# Altium schematic sheet FPGA power v3.SchDoc
size A; DocumentNumber: 2; SheetNumber: 2; SheetTotal: 6
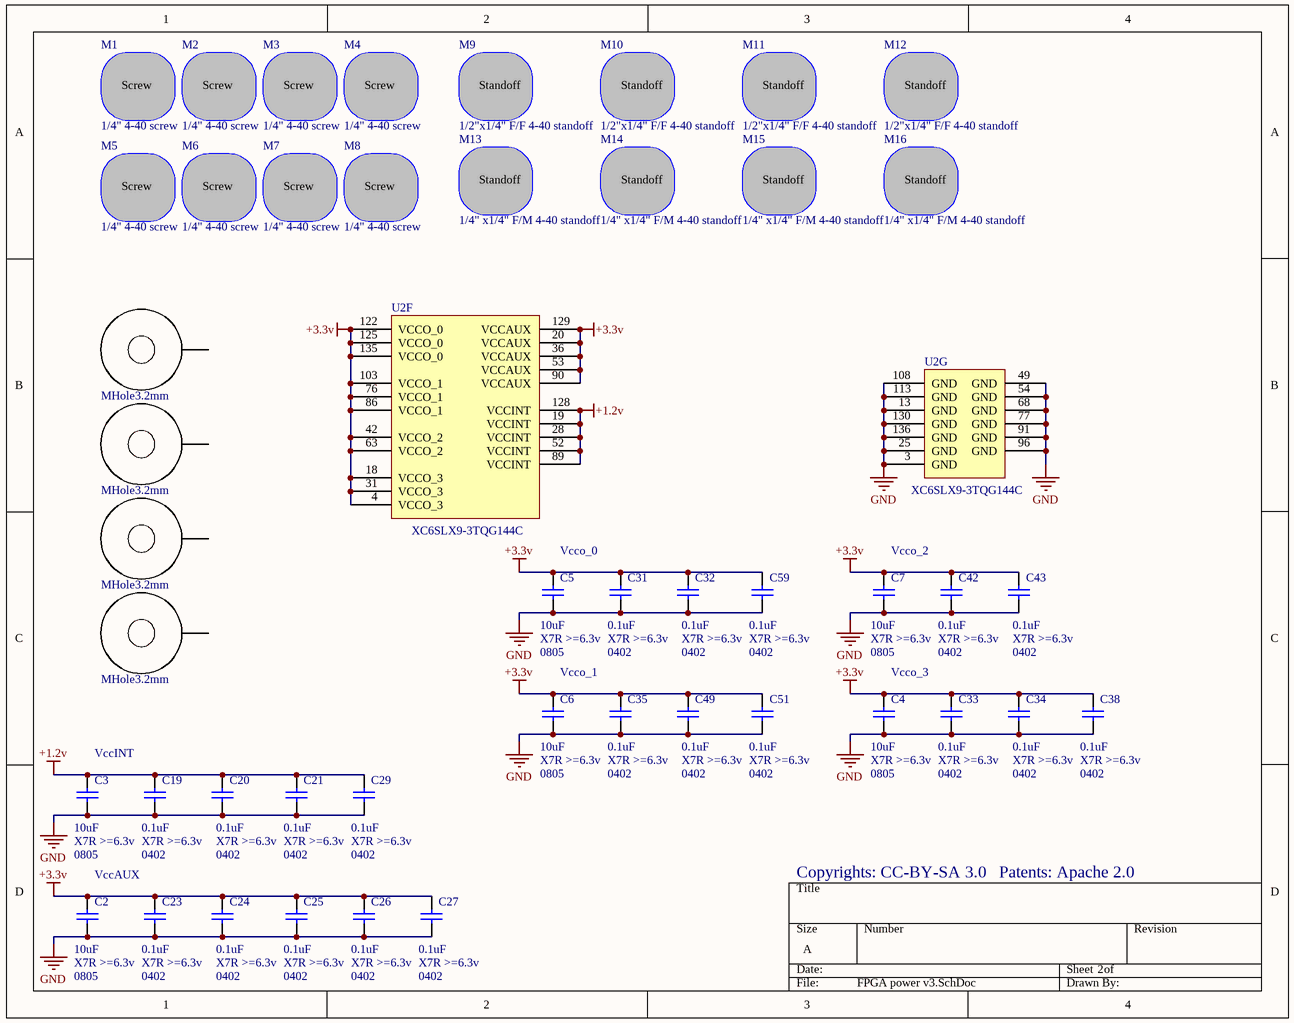
[diagram p0: FPGA power v3.SchDoc]

## Parts
C2  value 10uF  PackageReference: 0805  Rating: X7R >=6.3v  [CAPC2012N]  (hidden comment: Cap Semi)
C3  value 10uF  PackageReference: 0805  Rating: X7R >=6.3v  [CAPC2012N]  (hidden comment: Cap Semi)
C4  value 10uF  PackageReference: 0805  Rating: X7R >=6.3v  [CAPC2012N]  (hidden comment: Cap Semi)
C5  value 10uF  PackageReference: 0805  Rating: X7R >=6.3v  [CAPC2012N]  (hidden comment: Cap Semi)
C6  value 10uF  PackageReference: 0805  Rating: X7R >=6.3v  [CAPC2012N]  (hidden comment: Cap Semi)
C7  value 10uF  PackageReference: 0805  Rating: X7R >=6.3v  [CAPC2012N]  (hidden comment: Cap Semi)
C19  value 0.1uF  PackageReference: 0402  Rating: X7R >=6.3v  [CAPC1005N]  (hidden comment: Cap Semi)
C20  value 0.1uF  PackageReference: 0402  Rating: X7R >=6.3v  [CAPC1005N]  (hidden comment: Cap Semi)
C21  value 0.1uF  PackageReference: 0402  Rating: X7R >=6.3v  [CAPC1005N]  (hidden comment: Cap Semi)
C23  value 0.1uF  PackageReference: 0402  Rating: X7R >=6.3v  [CAPC1005N]  (hidden comment: Cap Semi)
C24  value 0.1uF  PackageReference: 0402  Rating: X7R >=6.3v  [CAPC1005N]  (hidden comment: Cap Semi)
C25  value 0.1uF  PackageReference: 0402  Rating: X7R >=6.3v  [CAPC1005N]  (hidden comment: Cap Semi)
C26  value 0.1uF  PackageReference: 0402  Rating: X7R >=6.3v  [CAPC1005N]  (hidden comment: Cap Semi)
C27  value 0.1uF  PackageReference: 0402  Rating: X7R >=6.3v  [CAPC1005N]  (hidden comment: Cap Semi)
C29  value 0.1uF  PackageReference: 0402  Rating: X7R >=6.3v  [CAPC1005N]  (hidden comment: Cap Semi)
C31  value 0.1uF  PackageReference: 0402  Rating: X7R >=6.3v  [CAPC1005N]  (hidden comment: Cap Semi)
C32  value 0.1uF  PackageReference: 0402  Rating: X7R >=6.3v  [CAPC1005N]  (hidden comment: Cap Semi)
C33  value 0.1uF  PackageReference: 0402  Rating: X7R >=6.3v  [CAPC1005N]  (hidden comment: Cap Semi)
C34  value 0.1uF  PackageReference: 0402  Rating: X7R >=6.3v  [CAPC1005N]  (hidden comment: Cap Semi)
C35  value 0.1uF  PackageReference: 0402  Rating: X7R >=6.3v  [CAPC1005N]  (hidden comment: Cap Semi)
C38  value 0.1uF  PackageReference: 0402  Rating: X7R >=6.3v  [CAPC1005N]  (hidden comment: Cap Semi)
C42  value 0.1uF  PackageReference: 0402  Rating: X7R >=6.3v  [CAPC1005N]  (hidden comment: Cap Semi)
C43  value 0.1uF  PackageReference: 0402  Rating: X7R >=6.3v  [CAPC1005N]  (hidden comment: Cap Semi)
C49  value 0.1uF  PackageReference: 0402  Rating: X7R >=6.3v  [CAPC1005N]  (hidden comment: Cap Semi)
C51  value 0.1uF  PackageReference: 0402  Rating: X7R >=6.3v  [CAPC1005N]  (hidden comment: Cap Semi)
C59  value 0.1uF  PackageReference: 0402  Rating: X7R >=6.3v  [CAPC1005N]  (hidden comment: Cap Semi)
H1  MHole3.2mm  [mounting hole]  (no BOM)
H2  MHole3.2mm  [mounting hole]  (no BOM)
H3  MHole3.2mm  [mounting hole]  (no BOM)
H4  MHole3.2mm  [mounting hole]  (no BOM)
M1  1/4" 4-40 screw  [fiducial]  (mechanical)
M2  1/4" 4-40 screw  [fiducial]  (mechanical)
M3  1/4" 4-40 screw  [fiducial]  (mechanical)
M4  1/4" 4-40 screw  [fiducial]  (mechanical)
M5  1/4" 4-40 screw  [fiducial]  (mechanical)
M6  1/4" 4-40 screw  [fiducial]  (mechanical)
M7  1/4" 4-40 screw  [fiducial]  (mechanical)
M8  1/4" 4-40 screw  [fiducial]  (mechanical)
M9  1/2"x1/4" F/F 4-40 standoff  [fiducial]  (mechanical)
M10  1/2"x1/4" F/F 4-40 standoff  [fiducial]  (mechanical)
M11  1/2"x1/4" F/F 4-40 standoff  [fiducial]  (mechanical)
M12  1/2"x1/4" F/F 4-40 standoff  [fiducial]  (mechanical)
M13  1/4" x1/4" F/M 4-40 standoff  [fiducial]  (mechanical)
M14  1/4" x1/4" F/M 4-40 standoff  [fiducial]  (mechanical)
M15  1/4" x1/4" F/M 4-40 standoff  [fiducial]  (mechanical)
M16  1/4" x1/4" F/M 4-40 standoff  [fiducial]  (mechanical)
U2  XC6SLX9-3TQG144C  [TQG144_N]  (parts F,G of 7)

## Nets
+1.2v: C3.2 C19.2 C20.2 C21.2 C29.2 U2.19(VCCINT) U2.28(VCCINT) U2.52(VCCINT) U2.89(VCCINT) U2.128(VCCINT)
+3.3v: C2.2 C4.2 C5.2 C6.2 C7.2 C23.2 C24.2 C25.2 C26.2 C27.2 C31.2 C32.2 C33.2 C34.2 C35.2 C38.2 C42.2 C43.2 C49.2 C51.2 C59.2 U2.4(VCCO_3) U2.18(VCCO_3) U2.20(VCCAUX) U2.31(VCCO_3) U2.36(VCCAUX) U2.42(VCCO_2) U2.53(VCCAUX) U2.63(VCCO_2) U2.76(VCCO_1) U2.86(VCCO_1) U2.90(VCCAUX) U2.103(VCCO_1) U2.122(VCCO_0) U2.125(VCCO_0) U2.129(VCCAUX) U2.135(VCCO_0)
GND: C2.1 C3.1 C4.1 C5.1 C6.1 C7.1 C19.1 C20.1 C21.1 C23.1 C24.1 C25.1 C26.1 C27.1 C29.1 C31.1 C32.1 C33.1 C34.1 C35.1 C38.1 C42.1 C43.1 C49.1 C51.1 C59.1 U2.3(GND) U2.13(GND) U2.25(GND) U2.49(GND) U2.54(GND) U2.68(GND) U2.77(GND) U2.91(GND) U2.96(GND) U2.108(GND) U2.113(GND) U2.130(GND) U2.136(GND)

Not connected (* = marked no-connect by the designer): H1 1; H2 1; H3 1; H4 1

## Notes on the sheet
- Vcco_0
- Vcco_2
- Vcco_1
- Vcco_3
- VccINT
- VccAUX
- Copyrights: CC-BY-SA 3.0
- Patents: Apache 2.0

## Library data of the parts
C2-C7 C19-C21 C23-C27 C29 C31-C35 C38 C42 C43 C49 C51 C59 = Cap Semi: Capacitor (Semiconductor SIM Model); Description: CAP CER 0.1UF 25V 10% X5R 0603; Tolerance: ±10%; Substitutable: yes
  C2-C7: Supplier 1: Mouser; Supplier Part Number 1: 81-GRM21BR61A106KE19
  C19-C21 C23-C27 C29 C31-C35 C38 C42 C43 C49 C51 C59: Supplier 1: Digi-Key; Supplier Part Number 1: 445-4703-1-ND; Supplier 2: Digi-Key; Supplier Part Number 2: 445-6854-1-ND
H1-H4 = 22898: Substitutable: DNP
M1-M8 = Screw: DigiKey Link: http://www.digikey.com/product-detail/en/PMSSS%20440%200025%20PH/H703-ND/274914; DigiKey Price/100: 0.0564; Mouser Link: https://www.mouser.com/Search/ProductDetail.aspx?R=9900virtualkey53400000virtualkey534-9900; Mouser Price/100: 0.06
M9-M12 = Standoff: DigiKey Link: http://www.digikey.com/product-detail/en/2203/2203K-ND/82512; DigiKey Price/100: 0.296; Mouser Link: https://www.mouser.com/Search/ProductDetail.aspx?R=2104-440-AL-7virtualkey68520000virtualkey761-2104-440-AL-7; Mouser Price/100: 0.19
M13-M16 = Standoff: 1/4"x1/4" F/M 4-40 standof; DigiKey Link: http://www.digikey.com/product-search/en?mpart=8714&vendor=36; DigiKey Price/100: 0.278; Mouser Link: https://www.mouser.com/Search/ProductDetail.aspx?R=8714virtualkey53400000virtualkey534-8714; Mouser Price/100: 0,281
U2 = XC6SLX9-3TQG144C: Spartan-6 LX 1.2V FPGA, 102 User I/Os, 144-Pin TQFP (0.5mm Pitch), Speed Grade 3, Commercial Grade, Pb-Free; Substitutable: no; PackageReference: TQG144; Value: XC6SLX9-3TQG144C